# Altium schematic sheet Ultrasonic main.SchDoc: Ultrahangos távolságmérő központi egység
size A3; Author: Rugási Krisztián; Engineer: Rugási Krisztián; DocumentNumber: 1; Revision: 1; SheetNumber: 1; SheetTotal: 1
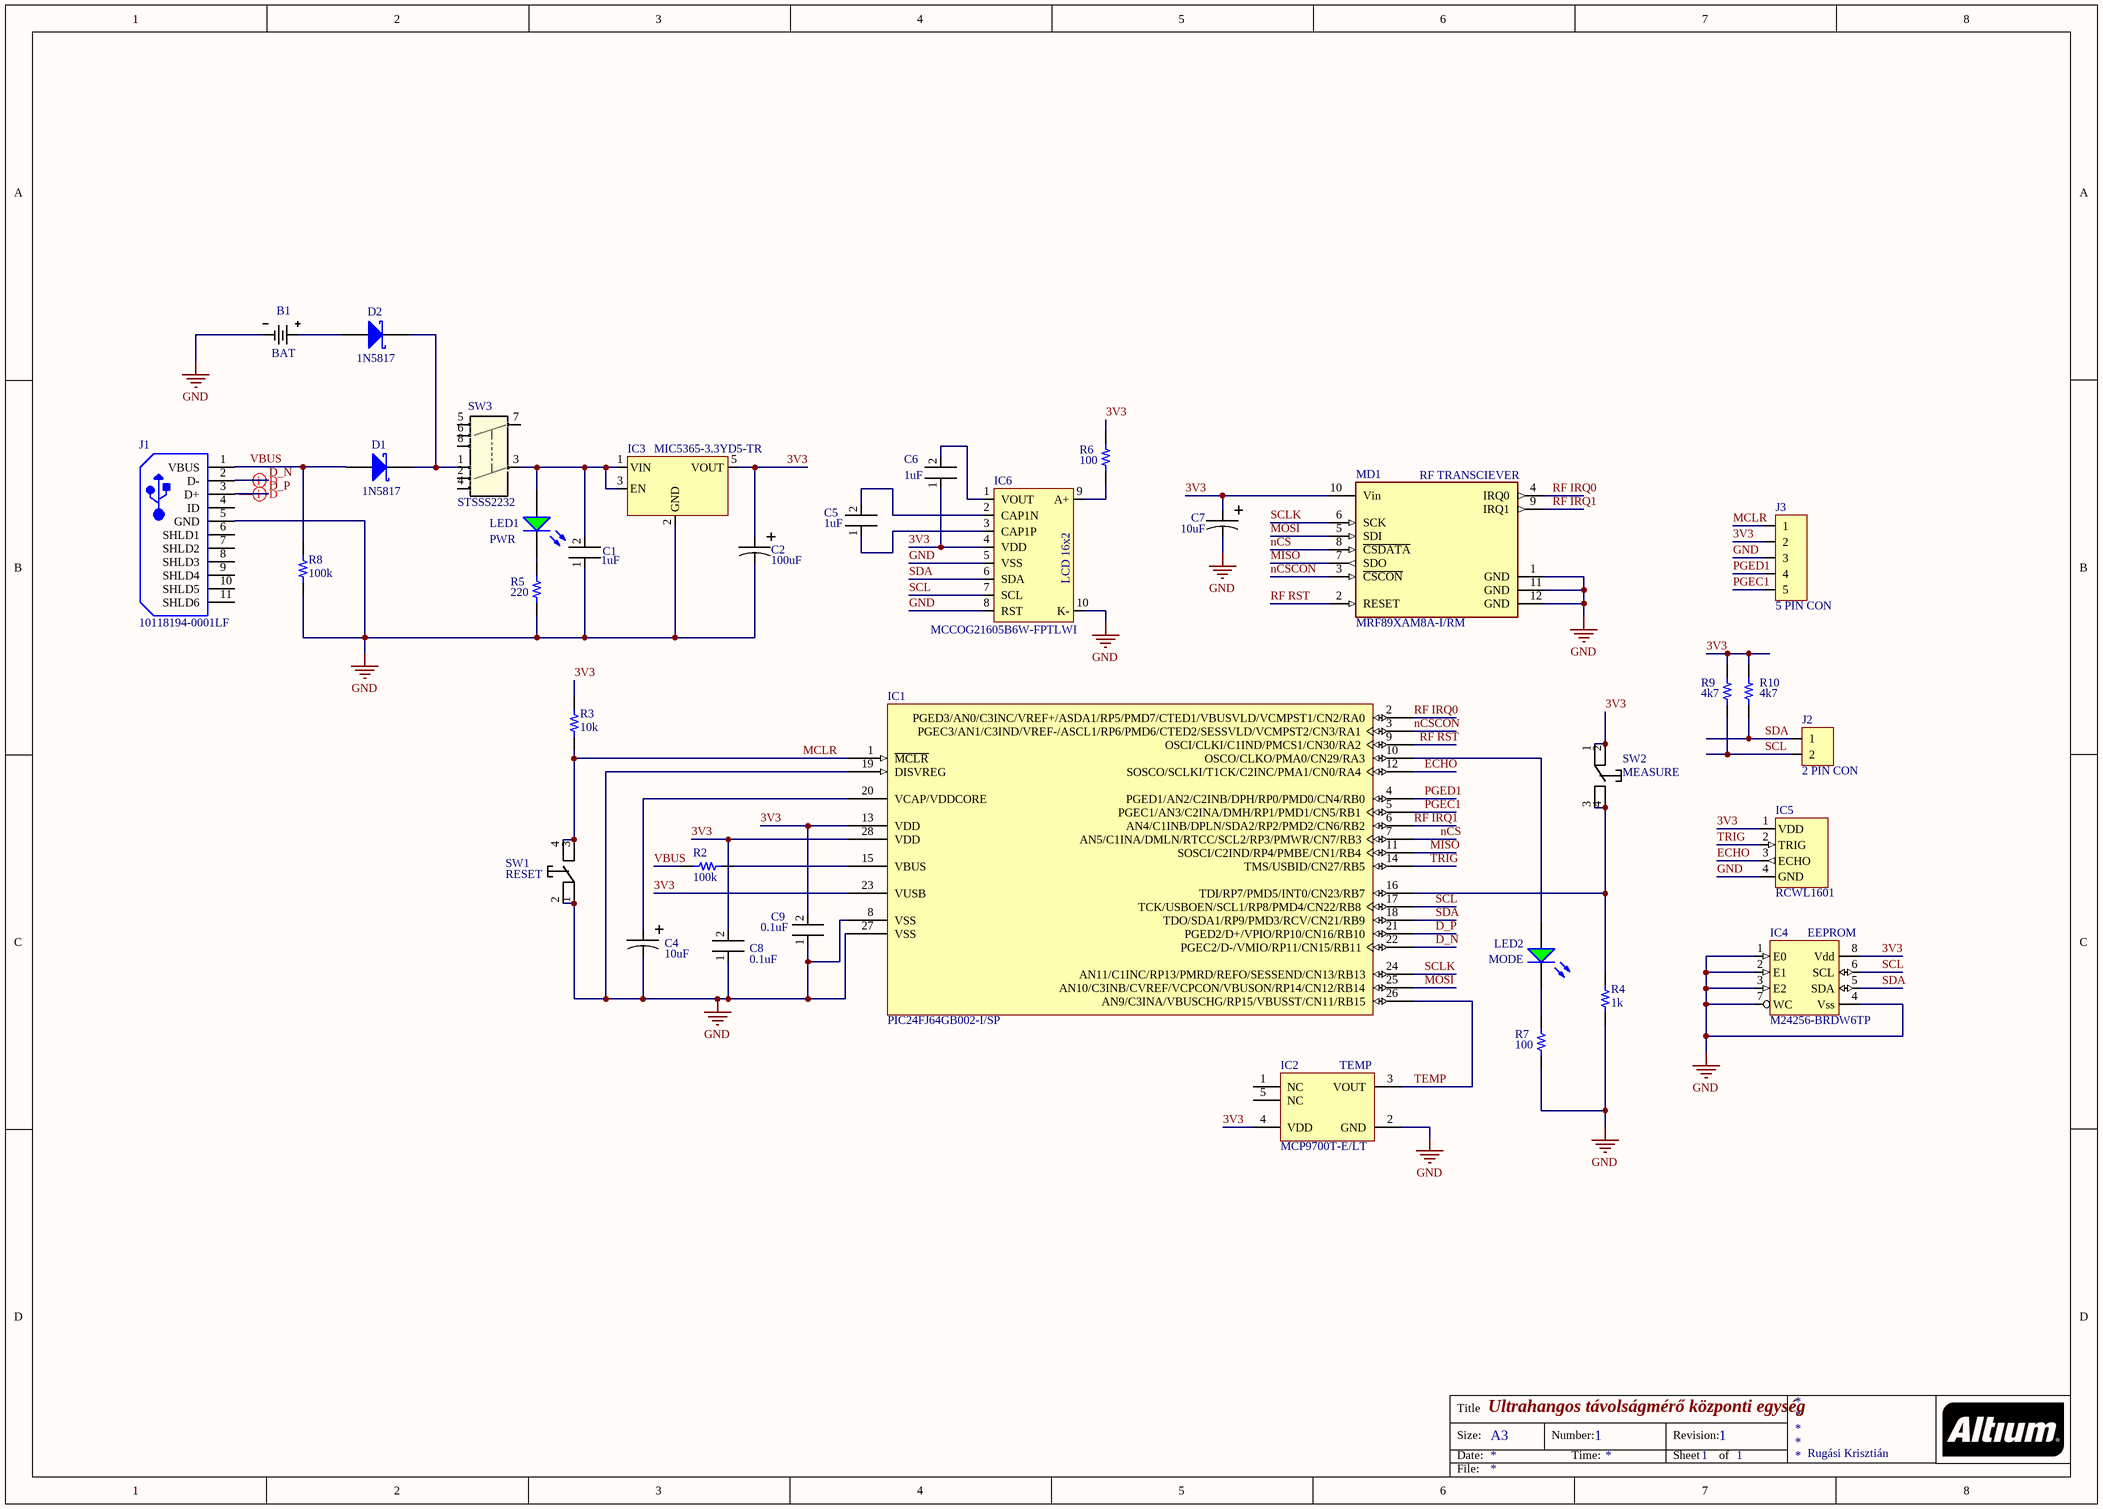
[diagram p0: Ultrasonic main.SchDoc]

## Parts
B1  BAT  [MP000342]
C1  1uF  [1206]
C2  100uF  [THT CAP POL 5mm]
C4  10uF  [THT CAP POL 5mm]
C5  1uF  [1206]
C6  1uF  [1206]
C7  10uF  [THT CAP POL 5mm]
C8  0.1uF  [1206]
C9  0.1uF  [1206]
D1  1N5817  [DIOD-DO-41-P-2]
D2  1N5817  [DIOD-DO-41-P-2]
IC1  PIC24FJ64GB002-I/SP  [SPDIP300-SP28]
IC2  MCP9700T-E/LT  [SC70-LT5_M]
IC3  MIC5365-3.3YD5-TR  [TSOT-23-5]
IC4  M24256-BRDW6TP  [TSSOP8 DW]
IC5  RCWL1601  [RCWL-1601]
IC6  MCCOG21605B6W-FPTLWI  [LCD MCCOG21605B6W-SPTLYI]
J1  10118194-0001LF  [FCI-10118194-0001LF-5_V]
J2  2 PIN CON  [2 PIN CON]
J3  5 PIN CON  [5 PIN CON]
LED1  PWR  [KING-L-934GD]
LED2  MODE  [KING-L-934GD]
MD1  MRF89XAM8A-I/RM  [FP-MRF89XAM8A-I-RM-0]
R2  100k  [RES 1206_3216]
R3  10k  [RES 1206_3216]
R4  1k  [RES 1206_3216]
R5  220  [RES 1206_3216]
R6  100  [RES 1206_3216]
R7  100  [RES 1206_3216]
R8  100k  [RES 1206_3216]
R9  4k7  [RES 1206_3216]
R10  4k7  [RES 1206_3216]
SW1  RESET  [FSM4JH]
SW2  MEASURE  [FSM4JH]
SW3  STSSS2232  [STSSS2232]

## Nets
GND: B1.1(-) C1.1 C2.2 C4.2 C7.2 C8.1 C9.1 IC1.8(VSS) IC1.19(DISVREG) IC1.27(VSS) IC2.2(GND) IC3.2(GND) IC4.1(E0) IC4.2(E1) IC4.3(E2) IC4.4(Vss) IC4.7(WC) IC5.4(GND) IC6.5(VSS) IC6.8(RST) IC6.10(K-) J1.5(GND) J3.3 MD1.1(GND) MD1.11(GND) MD1.12(GND) R4.1 R5.1 R7.1 R8.1 SW1.1 SW1.2
3V3: C2.1 C6.1 C7.1 C8.2 C9.2 IC1.13(VDD) IC1.23(VUSB) IC1.28(VDD) IC2.4(VDD) IC3.5(VOUT) IC4.8(Vdd) IC5.1(VDD) IC6.4(VDD) J3.2 MD1.10(Vin) R3.2 R6.2 R9.1 R10.2 SW2.1 SW2.2
D_N: IC1.22(PGEC2/D-/VMIO/RP11/CN15/RB11) J1.2(D-)
D_P: IC1.21(PGED2/D+/VPIO/RP10/CN16/RB10) J1.3(D+)
ECHO: IC1.12(SOSCO/SCLKI/T1CK/C2INC/PMA1/CN0/RA4) IC5.3(ECHO)
MCLR: IC1.1(~{MCLR}) J3.1 R3.1 SW1.3 SW1.4
MISO: IC1.11(SOSCI/C2IND/RP4/PMBE/CN1/RB4) MD1.7(SDO)
MOSI: IC1.25(AN10/C3INB/CVREF/VCPCON/VBUSON/RP14/CN12/RB14) MD1.5(SDI)
nCS: IC1.7(AN5/C1INA/DMLN/RTCC/SCL2/RP3/PMWR/CN7/RB3) MD1.8(~{CSDATA})
nCSCON: IC1.3(PGEC3/AN1/C3IND/VREF-/ASCL1/RP6/PMD6/CTED2/SESSVLD/VCMPST2/CN3/RA1) MD1.3(~{CSCON})
PGEC1: IC1.5(PGEC1/AN3/C2INA/DMH/RP1/PMD1/CN5/RB1) J3.5
PGED1: IC1.4(PGED1/AN2/C2INB/DPH/RP0/PMD0/CN4/RB0) J3.4
RF IRQ0: IC1.2(PGED3/AN0/C3INC/VREF+/ASDA1/RP5/PMD7/CTED1/VBUSVLD/VCMPST1/CN2/RA0) MD1.4(IRQ0)
RF IRQ1: IC1.6(AN4/C1INB/DPLN/SDA2/RP2/PMD2/CN6/RB2) MD1.9(IRQ1)
RF RST: IC1.9(OSCI/CLKI/C1IND/PMCS1/CN30/RA2) MD1.2(RESET)
SCL: IC1.17(TCK/USBOEN/SCL1/RP8/PMD4/CN22/RB8) IC4.6(SCL) IC6.7(SCL) J2.2 R9.2
SCLK: IC1.24(AN11/C1INC/RP13/PMRD/REFO/SESSEND/CN13/RB13) MD1.6(SCK)
SDA: IC1.18(TDO/SDA1/RP9/PMD3/RCV/CN21/RB9) IC4.5(SDA) IC6.6(SDA) J2.1 R10.1
TEMP: IC1.26(AN9/C3INA/VBUSCHG/RP15/VBUSST/CN11/RB15) IC2.3(VOUT)
TRIG: IC1.14(TMS/USBID/CN27/RB5) IC5.2(TRIG)
VBUS: D1.1(A) J1.1(VBUS) R2.1 R8.2
NetB1_2: B1.2(+) D2.1(A)
NetC1_2: C1.2 IC3.1(VIN) IC3.3(EN) LED1.1(A) SW3.3
NetC4_1: C4.1 IC1.20(VCAP/VDDCORE)
NetC5_1: C5.1 IC6.3(CAP1P)
NetC5_2: C5.2 IC6.2(CAP1N)
NetC6_2: C6.2 IC6.1(VOUT)
NetD1_2: D1.2(K) D2.2(K) SW3.1
NetIC1_10: IC1.10(OSCO/CLKO/PMA0/CN29/RA3) LED2.1(A)
NetIC1_15: IC1.15(VBUS) R2.2
NetIC1_16: IC1.16(TDI/RP7/PMD5/INT0/CN23/RB7) R4.2 SW2.3 SW2.4
NetIC6_9: IC6.9(A+) R6.1
NetLED1_2: LED1.2(K) R5.2
NetLED2_2: LED2.2(K) R7.2

Not connected (* = marked no-connect by the designer): IC2 1(NC) 5(NC); J1 4(ID) 6(SHLD1) 7(SHLD2) 8(SHLD3) 9(SHLD4) 10(SHLD5) 11(SHLD6); SW3 2 4 5 6 7 8

## Layout directives
differential pair: D_N, D_P

## Notes on the sheet
- (near MD1) RF TRANSCIEVER
- (near IC4) EEPROM
- (near IC2) TEMP
- Rugási Krisztián
- Title
- Size:
- Date:
- A3
- Number:
- Time:
- Revision:
- Sheet
- of
- File:
- (in symbol MCCOG21605B6W-SPTLYI) LCD 16x2

## Library data of the parts
B1 = BAT: Battery holder 3xAAA
C1 C5 C6 C8 C9 = MCGPR50V105M5X11: MCGPR50V105M5X11 ceramic
C2 C4 = CAP POL: aluminium electrolytic cap
C7 = CAP POL: aluminium electrolytic capacitor
D1 D2 = CMP-2000-05521-1: Schottky Barrier Rectifier, 1 A, 20 V, -65 to 125 degC, 2-Pin DO-41, RoHS, Tape and Reel; Manufacturer: DiodesIncorporated; Vrrm - Repetitive Reverse Voltage: 20V; If - Forward Current: 1A; Configuration: Single; Unit Weight: 0.010582oz; Type: SchottkyDiode; Ifsm - Forward Surge Current: 25A; Vf - Forward Voltage: 0.75Vat3A; Ir - Reverse Current: 1000uA; Technology: Si; Length: 5.21mm; Product: SchottkyRectifiers; Package Reference: DO-41-P-2; Package / Case: DO-41; Datasheet URL: http://www.diodes.com/_files/datasheets/ds23001.pdf; Operating Temperature Range: -65Cto+125C; Mounting Style: ThroughHole; Manufacturer URL: http://www.diodes.com/; Series: 1N58; Minimum Operating Temperature: -65C; Height: 2.72mm; Brand: DiodesIncorporated; Maximum Operating Temperature: +125C; Datasheet Version: Rev. 8-2, 05/2009; Factory Pack Quantity: 5000; Width: 2.72mm; RoHS: True; Product Category: SchottkyDiodes&Rectifiers; Package Description: 2-Pin Through Hole Device, Body 4.635 x 2.36 mm, Pin Spacing 7.85 mm; Packaging: Reel; Termination Style: ThroughHole; Mounting Technology: ThroughHole
IC1 = CMP-0046-00015-2: 16-Bit Flash Microcontroller with USB On-The-Go and nanoWatt XLP, 64KB Flash, 8KB SRAM, 28-Pin SPDIP, Industrial Temperature; ComponentLink2URL: http://www.microchip.com/stellent/groups/techpub_sg/documents/packagingspec/en012702.pdf; PackageDescription: 28-Lead Skinny Plastic Dual In-Line (SP) - 300 mil Body [SPDIP]; PackageVersion: revBB, Aug-2009; RevisionNote: Component URLs added.; DatasheetVersion: revD, Aug-2010; ComponentLink1Description: Datasheet; ComponentLink2Description: Packaging Specification; ComponentLink1URL: http://ww1.microchip.com/downloads/en/DeviceDoc/39940d.pdf; PackageReference: SPDIP300-SP28; ComponentLink3Description: Microchip.com Home; ComponentLink3URL: http://www.microchip.com/
IC2 = CMP-0192-00174-1: Low-Power Linear Active Thermistor IC, 5-Pin SC-70, Extended Temperature, Tape and Reel; PackageDescription: 5-Lead Plastic Small Outline Transistor (LT) [SC70]; DatasheetVersion: revE, Apr-2009; PackageVersion: revBB, Aug-2009; PackageReference: SC70-LT5; Code_IPC: SOT353-5
IC3 = MIC5365-3.3YD5-TR: LDO Voltage regulator 2.5V-5.5V in 3.3V out, 155mV drop, 150 mA out
IC4 = M24256-BRDW6TP: EEPROM 256kbit i2c
IC5 = RCWL1601: Ultrasonic distance sensor RCWL-1601, 10-5000mm 3V
IC6 = MCCOG21605B6W-SPTLYI: 3V-5V 16x2 character LCD
J1 = CMP-2000-05120-1: Micro USB B Type Receptacle, 1.8 A, -55 to 85 degC, 5-Pin SMD, RoHS, Tape and Reel; Manufacturer: Amphenol FCI; Body Orientation: RightAngle; Number of Contacts: 5; Pitch: 0.65mm; Gender: RCP; Rad Hard: No; Package Reference: 10118194-0001LF-5; Mounting: SurfaceMount; Manufacturer URL: http://www.fci.com/; Packaging: CutTape; Datasheet URL: https://datasheet.ciiva.com/26945/getdatasheetpartid-418619-26945695.pdf; Termination Method: Solder; Package Description: 5-Pin Surface Mount Device, Body 8.05 x 5.53 mm, Pitch 0.65 mm; Type: MicroUSBTypeB; Datasheet Version: Rev. A, 10/2011
J2 = 2 PIN CON: I2C header pin connectors
J3 = 5 PIN CON: ICSP programming pins
LED1 LED2 = CMP-2000-06531-1: Green Diffused LED, 2.1 V, 20 mA forward, -40 to 85 degC, 2-Pin THD, RoHS; Manufacturer: Kingbright; Viewing Angle: 60°; LED Material: GaP; Dominant Wavelength: 568nm; Lens Shape: Round; Forward Voltage: 2.2V; Luminous Intensity: 20mcd; Number of LEDs: 1; Datasheet URL: https://datasheet.ciiva.com/11773/0900766b801ff775-11773480.pdf; Package Reference: L-934GD; Series: Round; Manufacturer URL: http://www.kingbright.com/; Package Type: 3mm(T-1); Dimensions: 3x4.6mm; Package Description: 2-Pin Through Hole Device, Dia 3.2 mm, Body Length 4.9 mm; Datasheet Version: Rev. 1, 09/2001; Mounting Technology: ThroughHole; Number of Pins: 2; Lens Colour: Green; LED Colours: Green; Mounting Type: ThroughHole
MD1 = CMP-06331-000001-1: RF TXRX MOD ISM<1GHZ TRACE ANT; Manufacturer: Microchip; Bandwidth: 7MHz; Nominal Supply Current: 1.3mA; Data Rate: 40kbits/s; Max Supply Voltage: 3.6V; Interface: SPI; Transmitting Current: 25mA; Min Supply Voltage: 2.1V; Max Frequency: 870MHz; Receiving Current: 3mA; RoHS: TRUE; Category: UNK; Device Class L2: RF Semiconductors and Devices; Height: 0.075inch; Octopart: https://octopart.com/mrf89xam8a-i%2Frm-microchip-18902547; Manufacturer Part Number: MRF89XAM8A-I/RM; Device Class L1: Integrated Circuits (ICs); Ambient Temperature Range Low: -40°C; Package: MRF89XAM8A-I/RM; Automotive: No; Ambient Temperature Range High: +85°C; ComponentLink2Description: Datasheet; Mouser Description: RF Modules 868MHz Sub-GHz transceiver module; Digikey Description: RF TXRX MOD ISM<1GHZ TRACE ANT; Temperature Range Low: -40°C; ComponentLink2URL: http://ww1.microchip.com/downloads/en/DeviceDoc/70651A.pdf; Temperature Range High: +85°C; Temperature: -40°C to +85°C; Device Class L3: Transceivers; Lead Free: Yes
R2 R4 = RNCS1206BKE100K: RES 100K OHM 0.1% 1/8W 1206; Manufacturer: Stackpole Electronics Inc; Power (Watts): 0.125W, 1/8W; Resistance: 100 kOhms; Temperature Coefficient: ±25ppm/°C; Value: 100 kOhms; Part Number: RNCS1206BKE100K; ComponentLink1Description: Datasheet; ComponentLink1URL: https://www.seielect.com/catalog/sei-rncs_rnch.pdf; ComponentLink2Description: DigiKey Link; ComponentLink2URL: http://digikey.com/product-detail/en/stackpole-electronics-inc/RNCS1206BKE100K/RNCS1206BKE100KCT-ND/1800328; Composition: Thin Film; Device Package: 1206 (3216 Metric); Features: Anti-Corrosive, Automotive AEC-Q200, Moisture Resistant; Height - Seated (Max): 0.026" (0.65mm); LastUpdated: 2020-09-02 01:13:11; Lifecycle Status: Active; Minimum Order: 1; Number of Terminations: 2; Operating Temperature: -55°C ~ 155°C; Package / Case: 1206 (3216 Metric); Packaging: TapeAndReel; PartId: 26854; Part Status: Active; Price: 0.10; Ratings: AEC-Q200; Series: RNCS; Size / Dimension: 0.120" L x 0.061" W (3.05mm x 1.55mm); Supplier 1: DigiKey; Supplier Part Number 1: RNCS1206BKE100KCT-ND; Supplier Device Package: 1206; Tolerance: ±0.1%
R3 = CRG1206F10K: RES SMD 10K OHM 1% 1/4W 1206; Manufacturer: TE Connectivity Passive Product; Power (Watts): 0.25W, 1/4W; Resistance: 10 kOhms; Temperature Coefficient: ±100ppm/°C; Value: 10 kOhms; Part Number: CRG1206F10K; ComponentLink1Description: Datasheet; ComponentLink1URL: https://www.te.com/commerce/DocumentDelivery/DDEController?Action=srchrtrv&DocNm=1773204&DocType=DS&DocLang=English; ComponentLink2Description: DigiKey Link; ComponentLink2URL: http://digikey.com/product-detail/en/te-connectivity-passive-product/CRG1206F10K/A106069CT-ND/3477720; Composition: Thick Film; Device Package: 1206 (3216 Metric); Height - Seated (Max): 0.026" (0.65mm); LastUpdated: 2020-09-02 01:13:10; Lifecycle Status: Active; Minimum Order: 1; Number of Terminations: 2; Operating Temperature: -55°C ~ 155°C; Package / Case: 1206 (3216 Metric); Packaging: TapeAndReel; PartId: 26989; Part Status: Active; Price: 0.01; Series: CRG, Neohm; Size / Dimension: 0.122" L x 0.061" W (3.10mm x 1.55mm); Supplier 1: DigiKey; Supplier Part Number 1: A106069CT-ND; Supplier Device Package: 1206; Tolerance: ±1%
R5-R7 = RT1206BRD071ML: RES SMD 1M OHM 0.1% 1/4W 1206; Manufacturer: Yageo; Power (Watts): 0.25W, 1/4W; Resistance: 1 MOhms; Temperature Coefficient: ±25ppm/°C; Value: 1 MOhms; Part Number: RT1206BRD071ML; ComponentLink1Description: Datasheet; ComponentLink1URL: https://www.yageo.com/upload/media/product/productsearch/datasheet/rchip/PYu-RT_1-to-0.01_RoHS_L_11.pdf; ComponentLink2Description: DigiKey Link; ComponentLink2URL: http://digikey.com/product-detail/en/yageo/RT1206BRD071ML/YAG2022CT-ND/5139470; Composition: Thin Film; Device Package: 1206 (3216 Metric); Height - Seated (Max): 0.026" (0.65mm); LastUpdated: 2020-09-02 01:13:11; Lifecycle Status: Active; Minimum Order: 1; Number of Terminations: 2; Operating Temperature: -55°C ~ 155°C; Package / Case: 1206 (3216 Metric); Packaging: TapeAndReel; PartId: 26858; Part Status: Active; Price: 0.10; Series: RT; Size / Dimension: 0.122" L x 0.063" W (3.10mm x 1.60mm); Supplier 1: DigiKey; Supplier Part Number 1: YAG2022CT-ND; Supplier Device Package: 1206; Tolerance: ±0.1%
R8 = CRG1206F10K: RES SMD 100K OHM 1% 1/4W 1206; Manufacturer: TE Connectivity Passive Product; Power (Watts): 0.25W, 1/4W; Resistance: 10 kOhms; Temperature Coefficient: ±100ppm/°C; Value: 10 kOhms; Part Number: CRG1206F10K; ComponentLink1Description: Datasheet; ComponentLink1URL: https://www.te.com/commerce/DocumentDelivery/DDEController?Action=srchrtrv&DocNm=1773204&DocType=DS&DocLang=English; ComponentLink2Description: DigiKey Link; ComponentLink2URL: http://digikey.com/product-detail/en/te-connectivity-passive-product/CRG1206F10K/A106069CT-ND/3477720; Composition: Thick Film; Device Package: 1206 (3216 Metric); Height - Seated (Max): 0.026" (0.65mm); LastUpdated: 2020-09-02 01:13:10; Lifecycle Status: Active; Minimum Order: 1; Number of Terminations: 2; Operating Temperature: -55°C ~ 155°C; Package / Case: 1206 (3216 Metric); Packaging: TapeAndReel; PartId: 26989; Part Status: Active; Price: 0.01; Series: CRG, Neohm; Size / Dimension: 0.122" L x 0.061" W (3.10mm x 1.55mm); Supplier 1: DigiKey; Supplier Part Number 1: A106069CT-ND; Supplier Device Package: 1206; Tolerance: ±1%
R9 R10 = CRG1206F4K7: RES SMD 4.7K OHM 1% 1/4W 1206; Manufacturer: TE Connectivity Passive Product; Power (Watts): 0.25W, 1/4W; Resistance: 4.7 kOhms; Temperature Coefficient: ±100ppm/°C; Value: 4.7 kOhms; Part Number: CRG1206F4K7; ComponentLink1Description: Datasheet; ComponentLink1URL: https://www.te.com/commerce/DocumentDelivery/DDEController?Action=srchrtrv&DocNm=1773204&DocType=DS&DocLang=English; ComponentLink2Description: DigiKey Link; ComponentLink2URL: http://digikey.com/product-detail/en/te-connectivity-passive-product/CRG1206F4K7/A106078CT-ND/3477735; Composition: Thick Film; Device Package: 1206 (3216 Metric); Height - Seated (Max): 0.026" (0.65mm); LastUpdated: 2020-09-02 01:13:10; Lifecycle Status: Active; Minimum Order: 1; Number of Terminations: 2; Operating Temperature: -55°C ~ 155°C; Package / Case: 1206 (3216 Metric); Packaging: TapeAndReel; PartId: 26987; Part Status: Active; Price: 0.01; Series: CRG, Neohm; Size / Dimension: 0.122" L x 0.061" W (3.10mm x 1.55mm); Supplier 1: DigiKey; Supplier Part Number 1: A106078CT-ND; Supplier Device Package: 1206; Tolerance: ±1%
SW1 SW2 = SW_TACT: TACT SW, 50mA, 24V
SW3 = STSSS2232: Sliding switch, 3-POS  DP3T, 3 A, 18 V